# EasyEDA Pro project Mei_v2_EasyEDA_Project.epro

# Schematic Schematic1
Board Name: Board1; Create Date: 2026-04-22; Page Name: P1; Project Name: Mei v2 Autonomous Watering System; Schematic Name: Schematic1; Update Date: 2026-04-25; Company: EasyEDA.com; Page Size: A4; Version: V1.0
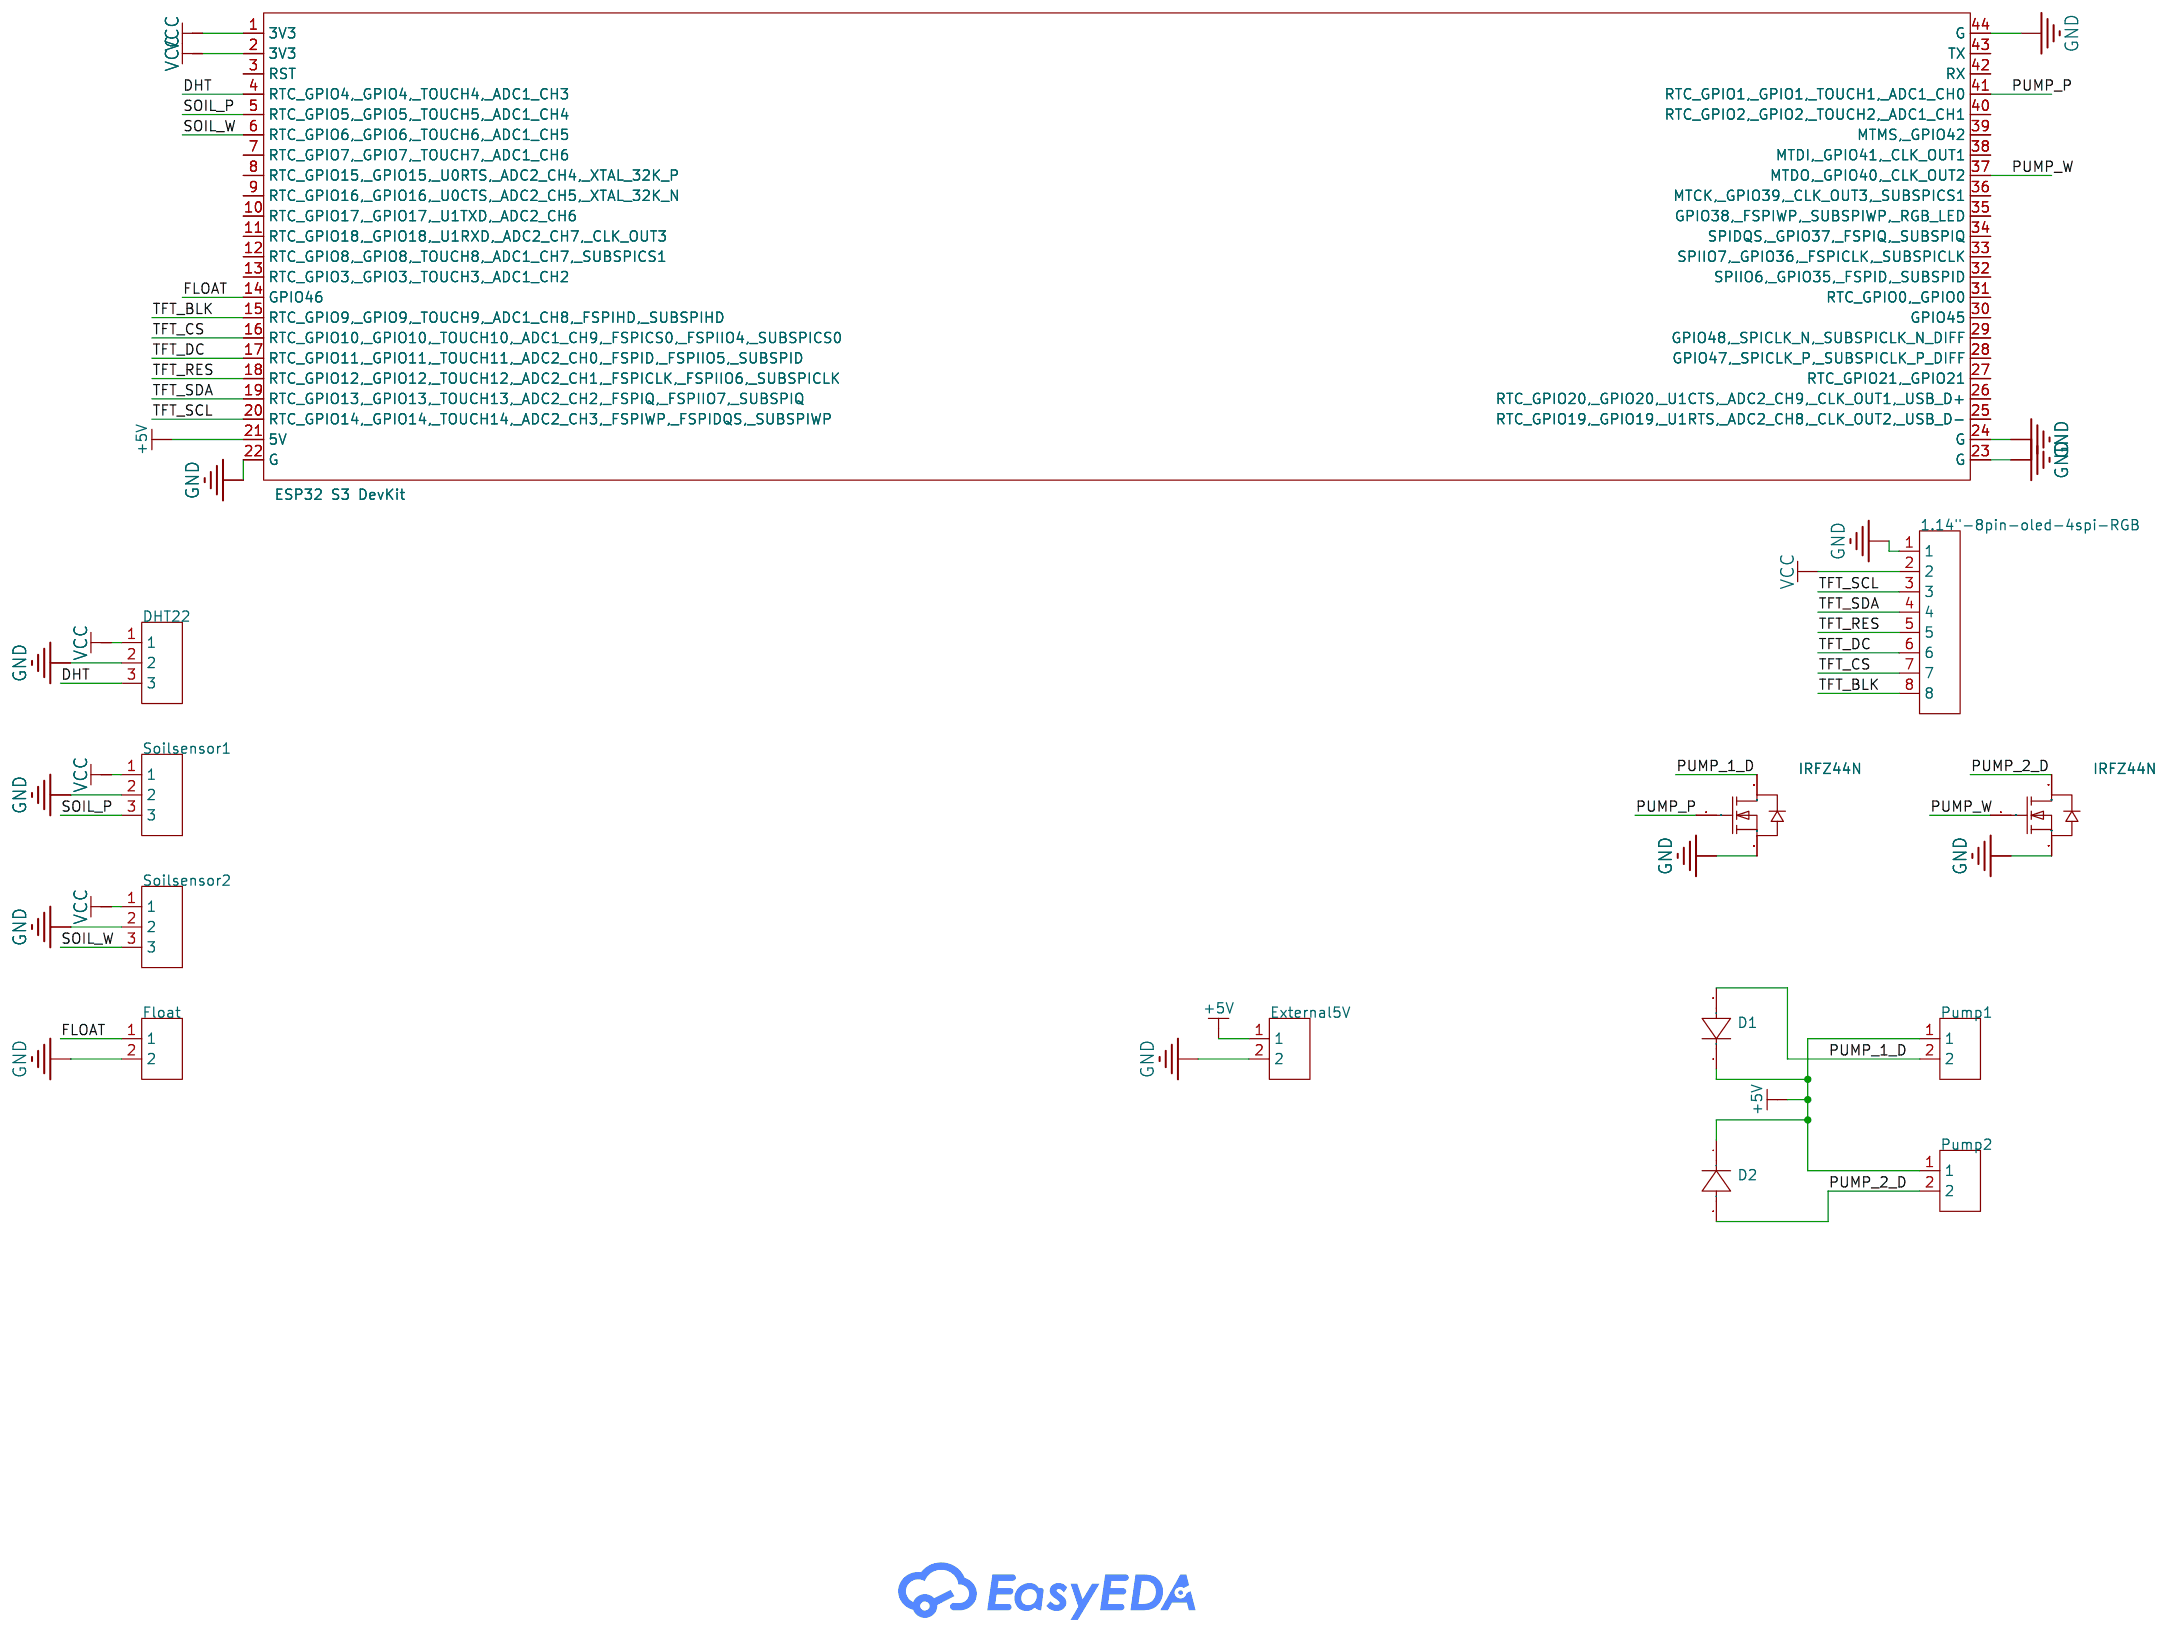
[diagram p0: schematic sheet]

## Parts
1.14"-8pin-oled-4spi-RGB  1.14"-8pin-oled-4spi-RGB  [CONN-TH_8P-P2.54_XH2.54_C9900012080]
D1  -  [DO-41_BD2.4-L4.7-P8.70-D0.9-RD]
D2  -  [DO-41_BD2.4-L4.7-P8.70-D0.9-RD]
DHT22  DHT22  [CONN-TH_3P-P2.50_HX-XHB2.54-3PZZ]
External5V  External 5V  [CONN-TH_2P-P2.50_HX-XHB2.54-2PZZ]
Float  Float  [CONN-TH_2P-P2.50_HX-XHB2.54-2PZZ]
IRFZ44N  IRFZ44N  [TO-220-3_L9.9-W4.5-P2.54-L]
IRFZ44N#2  IRFZ44N  [TO-220-3_L9.9-W4.5-P2.54-L]
Pump1  Pump 1  [CONN-TH_2P-P2.50_HX-XHB2.54-2PZZ]
Pump2  Pump 2  [CONN-TH_2P-P2.50_HX-XHB2.54-2PZZ]
Soilsensor1  Soil sensor 1  [CONN-TH_3P-P2.50_HX-XHB2.54-3PZZ]
Soilsensor2  Soil sensor 2  [CONN-TH_3P-P2.50_HX-XHB2.54-3PZZ]
U2  ESP32 S3 DevKit  [CONN-TH_ESP32-S3-DEVKITC-1U-N8]

## Library data of the parts
1.14"-8pin-oled-4spi-RGB = XH2.54-8: Supplier Part: C9900012080; JLCPCB Part Class: Extended Part; Supplier: LCSC
D1 D2 = 1N4007: Supplier Footprint: DO-41
DHT22 Soilsensor1 Soilsensor2 = HX-XHB2.54-3PZZ: Pins Structure:1x3P Pitch:2.5mm Mounting Type:Through Hole Reference Series:XHB Number of Pins:3P Number of Rows:1 Number of PINs Per Row:3 Row Spacing:- Current Rating:3A Contact Material:Brass Contact Plating:Tin Operating Temperature:-25℃~+85℃ Operatin; LCSC Part Name: 1x3P 间距:2.5mm 直插 系列:XHB; Supplier Part: C48641732; Manufacturer: hanxia(韩下); Supplier Footprint: 插件,P=2.5mm; JLCPCB Part Class: Extended Part; Datasheet: https://item.szlcsc.com/datasheet/HX-XHB2.54-3PZZ/50919928.html; Supplier: LCSC; Pins Structure: 1x3P; Pitch: 2.5mm; Mounting Type: Through Hole; Reference Series: XHB; Number of Pins: 3P; Number of Rows: 1; Number of PINs Per Row: 3; Current Rating: 3A; Contact Material: Brass; Contact Plating: Tin; Operating Temperature: -25℃~+85℃; Voltage Rating: 250V; Plastic Material: PA66; Flame Retardant Rating: UL94V-0; Color: White
External5V Float Pump1 Pump2 = HX-XHB2.54-2PZZ: Pins Structure:1x2P Pitch:2.5mm Mounting Type:Through Hole Reference Series:XHB Number of Pins:2P Number of Rows:1 Number of PINs Per Row:2 Row Spacing:- Current Rating:3A Contact Material:Brass Contact Plating:Tin Operating Temperature:-25℃~+85℃ Operatin; LCSC Part Name: 1x2P 间距:2.5mm 直插 系列:XHB; Supplier Part: C48641731; Manufacturer: hanxia(韩下); Supplier Footprint: 插件,P=2.5mm; JLCPCB Part Class: Extended Part; Datasheet: https://item.szlcsc.com/datasheet/HX-XHB2.54-2PZZ/50919927.html; Supplier: LCSC; Pins Structure: 1x2P; Pitch: 2.5mm; Mounting Type: Through Hole; Reference Series: XHB; Number of Pins: 2P; Number of Rows: 1; Number of PINs Per Row: 2; Current Rating: 3A; Contact Material: Brass; Contact Plating: Tin; Operating Temperature: -25℃~+85℃; Voltage Rating: 250V; Plastic Material: PA66; Flame Retardant Rating: UL94V-0; Color: White
IRFZ44N IRFZ44N#2 = IRFZ44N: Number:1 N-Channel Drain to Source Voltage:60V Current - Continuous Drain(Id):60A RDS(on):12mΩ@10V,25A Pd - Power Dissipation:87W Gate Threshold Voltage (Vgs(th)@Id):3V Gate Charge(Qg):31nC@10V Input Capacitance(Ciss):910pF@25V Reverse Transfer Capacitanc; LCSC Part Name: 1个N沟道 耐压:60V 电流:60A; Supplier Part: C7429904; Manufacturer: minos(迈诺斯); Supplier Footprint: TO-220; JLCPCB Part Class: Extended Part; Datasheet: https://item.szlcsc.com/datasheet/IRFZ44N/8428625.html; Supplier: LCSC; Number: 1 N-Channel; Drain to Source Voltage: 60V; Current - Continuous Drain(Id): 60A; RDS(on): 12mΩ@10V,25A; Pd - Power Dissipation: 87W; Gate Threshold Voltage (Vgs(th)@Id): 3V; Gate Charge(Qg): 31nC@10V; Input Capacitance(Ciss): 910pF@25V; Reverse Transfer Capacitance (Crss@Vds): 30pF@25V; Operating Temperature: -55℃~+175℃@(Tj)
U2 = ESP32-S3-DEVKITC-1-N8R8: LCSC Part Name: 不带固件; Supplier Part: C20541519; Manufacturer: ESPRESSIF(乐鑫); JLCPCB Part Class: Extended Part; Supplier: LCSC

## Nets
+5V: D1.1(K) D2.1(K) External5V.1 Pump1.1 Pump2.1 U2.21(5V)
GND: 1.14"-8pin-oled-4spi-RGB.1 DHT22.2 External5V.2 Float.2 IRFZ44N.3(S) IRFZ44N#2.3(S) Soilsensor1.2 Soilsensor2.2 U2.22(G) U2.23(G) U2.24(G) U2.44(G)
VCC: 1.14"-8pin-oled-4spi-RGB.2 DHT22.1 Soilsensor1.1 Soilsensor2.1 U2.1(3V3) U2.2(3V3)
DHT: DHT22.3 U2.4(RTC_GPIO4, GPIO4, TOUCH4, ADC1_CH3)
FLOAT: Float.1 U2.14(GPIO46)
PUMP_1_D: D1.2(A) IRFZ44N.2(D) Pump1.2
PUMP_2_D: D2.2(A) IRFZ44N#2.2(D) Pump2.2
PUMP_P: IRFZ44N.1(G) U2.41(RTC_GPIO1, GPIO1, TOUCH1, ADC1_CH0)
PUMP_W: IRFZ44N#2.1(G) U2.37(MTDO, GPIO40, CLK_OUT2)
SOIL_P: Soilsensor1.3 U2.5(RTC_GPIO5, GPIO5, TOUCH5, ADC1_CH4)
SOIL_W: Soilsensor2.3 U2.6(RTC_GPIO6, GPIO6, TOUCH6, ADC1_CH5)
TFT_BLK: 1.14"-8pin-oled-4spi-RGB.8 U2.15(RTC_GPIO9, GPIO9, TOUCH9, ADC1_CH8, FSPIHD, SUBSPIHD)
TFT_CS: 1.14"-8pin-oled-4spi-RGB.7 U2.16(RTC_GPIO10, GPIO10, TOUCH10, ADC1_CH9, FSPICS0, FSPIIO4, SUBSPICS0)
TFT_DC: 1.14"-8pin-oled-4spi-RGB.6 U2.17(RTC_GPIO11, GPIO11, TOUCH11, ADC2_CH0, FSPID, FSPIIO5, SUBSPID)
TFT_RES: 1.14"-8pin-oled-4spi-RGB.5 U2.18(RTC_GPIO12, GPIO12, TOUCH12, ADC2_CH1, FSPICLK, FSPIIO6, SUBSPICLK)
TFT_SCL: 1.14"-8pin-oled-4spi-RGB.3 U2.20(RTC_GPIO14, GPIO14, TOUCH14, ADC2_CH3, FSPIWP, FSPIDQS, SUBSPIWP)
TFT_SDA: 1.14"-8pin-oled-4spi-RGB.4 U2.19(RTC_GPIO13, GPIO13, TOUCH13, ADC2_CH2, FSPIQ, FSPIIO7, SUBSPIQ)

Not connected (* = marked no-connect by the designer): U2 3(RST) 7(RTC_GPIO7, GPIO7, TOUCH7, ADC1_CH6) 8(RTC_GPIO15, GPIO15, U0RTS, ADC2_CH4, XTAL_32K_P) 9(RTC_GPIO16, GPIO16, U0CTS, ADC2_CH5, XTAL_32K_N) 10(RTC_GPIO17, GPIO17, U1TXD, ADC2_CH6) 11(RTC_GPIO18, GPIO18, U1RXD, ADC2_CH7, CLK_OUT3) 12(RTC_GPIO8, GPIO8, TOUCH8, ADC1_CH7, SUBSPICS1) 13(RTC_GPIO3, GPIO3, TOUCH3, ADC1_CH2) 25(RTC_GPIO19, GPIO19, U1RTS, ADC2_CH8, CLK_OUT2, USB_D-) 26(RTC_GPIO20, GPIO20, U1CTS, ADC2_CH9, CLK_OUT1, USB_D+) 27(RTC_GPIO21, GPIO21) 28(GPIO47, SPICLK_P, SUBSPICLK_P_DIFF) 29(GPIO48, SPICLK_N, SUBSPICLK_N_DIFF) 30(GPIO45) 31(RTC_GPIO0, GPIO0) 32(SPIIO6, GPIO35, FSPID, SUBSPID) 33(SPIIO7, GPIO36, FSPICLK, SUBSPICLK) 34(SPIDQS, GPIO37, FSPIQ, SUBSPIQ) 35(GPIO38, FSPIWP, SUBSPIWP, RGB LED) 36(MTCK, GPIO39, CLK_OUT3, SUBSPICS1) 38(MTDI, GPIO41, CLK_OUT1) 39(MTMS, GPIO42) 40(RTC_GPIO2, GPIO2, TOUCH2, ADC1_CH1) 42(RX) 43(TX)

# Board PCB3
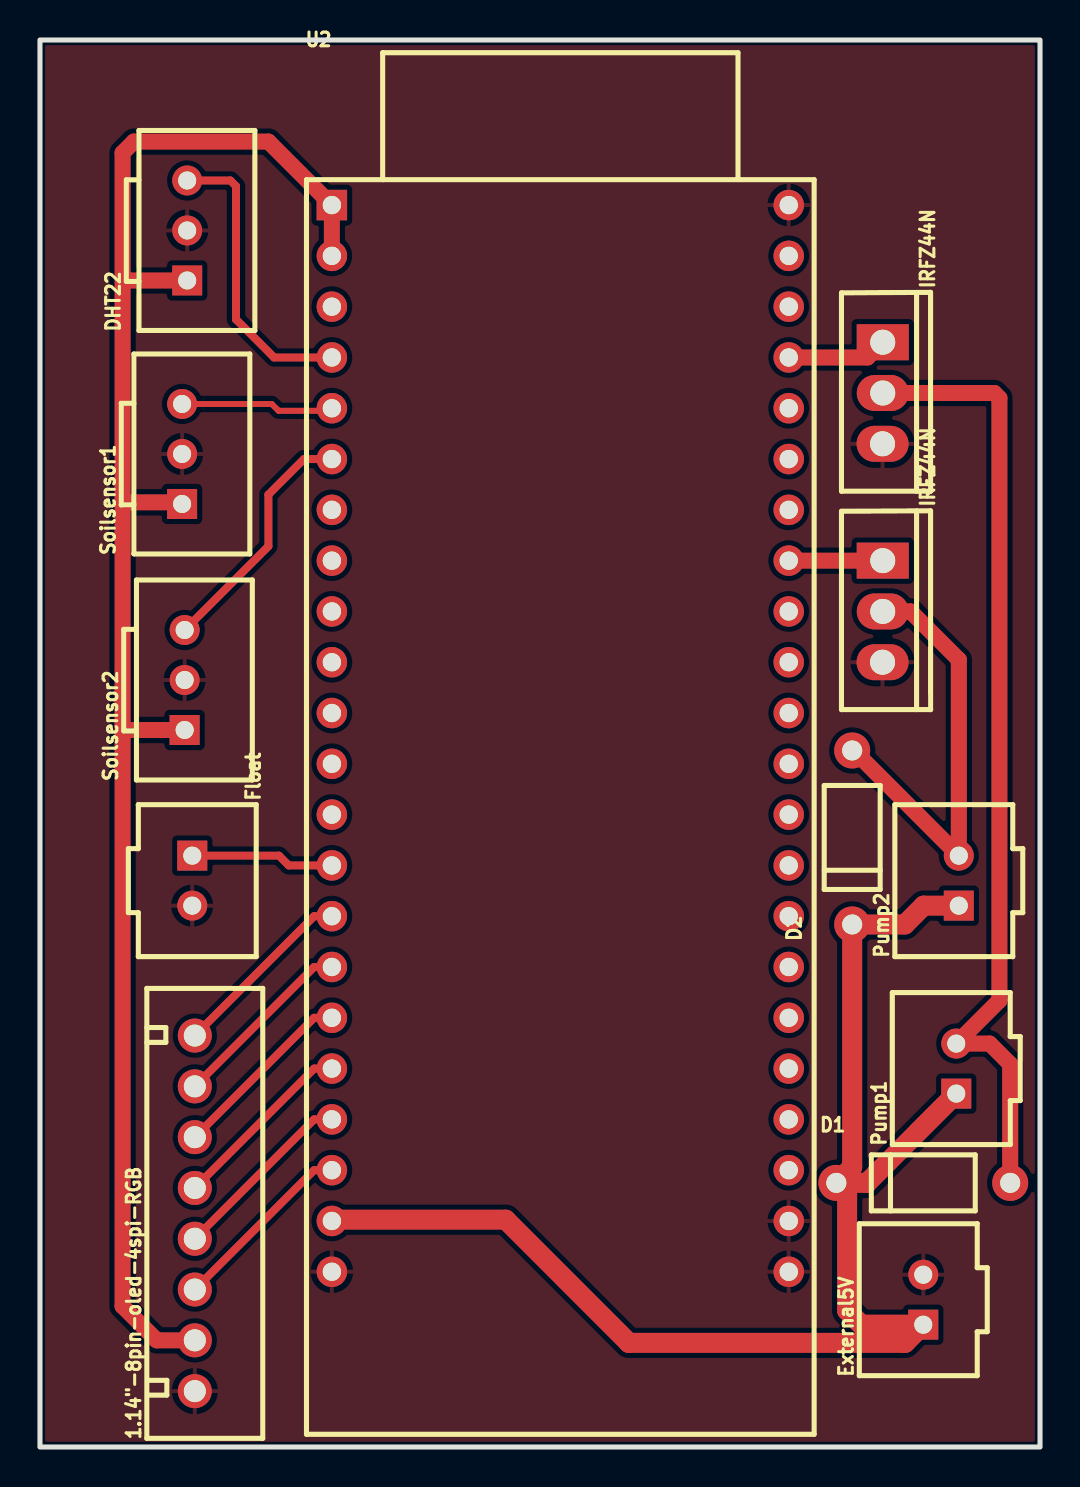
[diagram p1: board, top side]
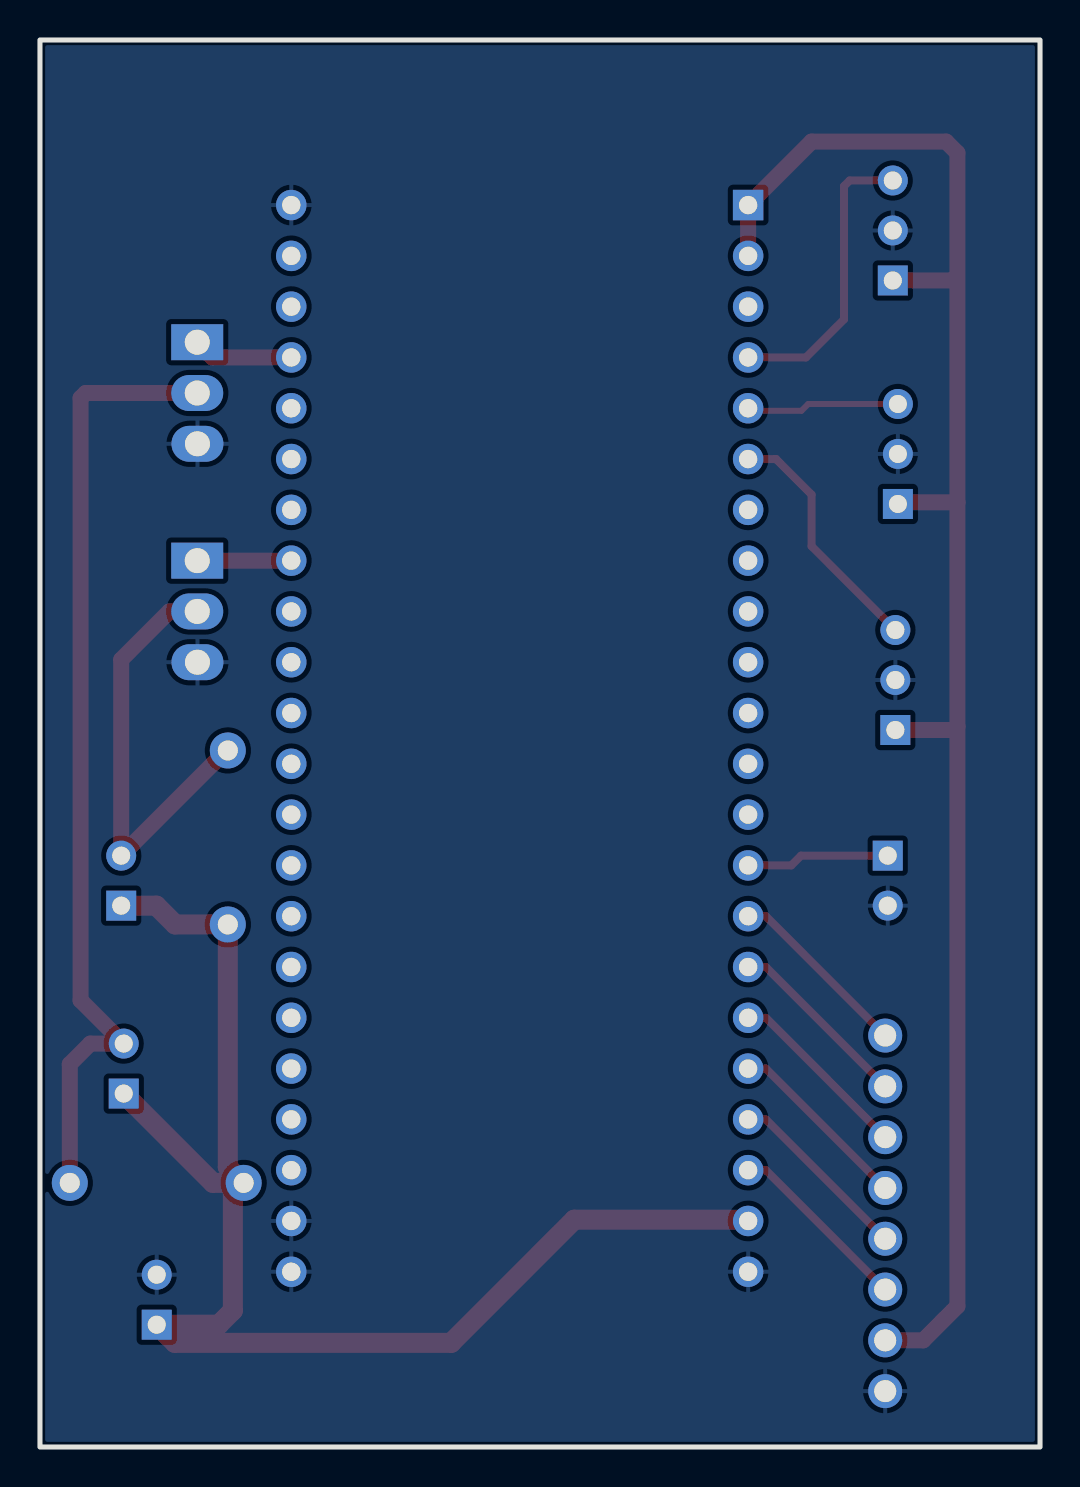
[diagram p2: board, bottom side, seen from below]

Outline 50.04 x 70.36 mm; copper layers: Top Layer, Bottom Layer. Coordinates in mm from the lower left corner of the outline.
Outline path: rectangle 0,70.36 50.04,0
Stack: Top Layer 0.035mm / Dielectric1 1.51mm FR4 er 4.5 / Bottom Layer 0.035mm

## Design rules (mm)
template: Custom Config
spacing copperThickness1oz (default): track to track 0.102, other pairs 0.152 to 0.3
spacing copperThickness2oz: track to track 0.203, other pairs 0.152 to 0.3
track width copperThickness1oz (default): min 0.127, default 0.254, max 2.54
track width copperThickness2oz: min 0.203, default 0.254, max 2.54
differential pair differentialPair (default): width min 0.127, default 0.254, max 2.54; gap min 0.152, default 0.152
via viaSize (default): diameter min 0.5, default 0.61, max 10; hole min 0.3, default 0.305, max 6.3
net GND uses copperRegiondeneme

## Placement (name value [footprint] x y rotation side)
1.14"-8pin-oled-4spi-RGB  1.14"-8pin-oled-4spi-RGB  [CONN-TH_8P-P2.54_XH2.54_C9900012080]  7.75 11.68 90 top
D1  -  [DO-41_BD2.4-L4.7-P8.70-D0.9-RD]  44.2 13.21 0 top
D2  -  [DO-41_BD2.4-L4.7-P8.70-D0.9-RD]  40.64 30.48 90 top
DHT22  DHT22  [CONN-TH_3P-P2.50_HX-XHB2.54-3PZZ]  7.37 60.83 90 top
External5V  External 5V  [CONN-TH_2P-P2.50_HX-XHB2.54-2PZZ]  44.2 7.37 90 top
Float  Float  [CONN-TH_2P-P2.50_HX-XHB2.54-2PZZ]  7.62 28.32 270 top
IRFZ44N  IRFZ44N  [TO-220-3_L9.9-W4.5-P2.54-L]  42.16 52.7 270 top
IRFZ44N#2  IRFZ44N  [TO-220-3_L9.9-W4.5-P2.54-L]  42.16 41.78 270 top
Pump1  Pump 1  [CONN-TH_2P-P2.50_HX-XHB2.54-2PZZ]  45.85 18.92 90 top
Pump2  Pump 2  [CONN-TH_2P-P2.50_HX-XHB2.54-2PZZ]  45.97 28.32 90 top
Soilsensor1  Soil sensor 1  [CONN-TH_3P-P2.50_HX-XHB2.54-3PZZ]  7.11 49.66 90 top
Soilsensor2  Soil sensor 2  [CONN-TH_3P-P2.50_HX-XHB2.54-3PZZ]  7.24 38.35 90 top
U2  ESP32 S3 DevKit  [CONN-TH_ESP32-S3-DEVKITC-1U-N8]  26.03 35.43 0 top

## Footprints (pads in the part's own frame, mm; a bottom-side part is the same pattern mirrored in y, then rotated)
CONN-TH_2P-P2.50_HX-XHB2.54-2PZZ
  rect 1.5x1.5 hole 0.9: 1(-1.25,0)
  round 1.5 hole 0.9: 2(1.25,0)
CONN-TH_3P-P2.50_HX-XHB2.54-3PZZ
  rect 1.5x1.5 hole 0.9: 1(-2.5,0)
  round 1.5 hole 0.9: 2(0,0) 3(2.5,0)
CONN-TH_8P-P2.54_XH2.54_C9900012080
  round 1.7 hole 1.1: 1(-8.89,0) 2(-6.35,0) 3(-3.81,0) 4(-1.27,0) 5(1.27,0) 6(3.81,0) 7(6.35,0) 8(8.89,0)
CONN-TH_ESP32-S3-DEVKITC-1U-N8
  rect 1.524x1.524 hole 0.914: 1(-11.43,26.67)
  round 1.524 hole 0.914: 2(-11.43,24.13) 3(-11.43,21.59) 4(-11.43,19.05) 5(-11.43,16.51) 6(-11.43,13.97) 7(-11.43,11.43) 8(-11.43,8.89) 9(-11.43,6.35) 10(-11.43,3.81) 11(-11.43,1.27) 12(-11.43,-1.27) 13(-11.43,-3.81) 14(-11.43,-6.35) 15(-11.43,-8.89) 16(-11.43,-11.43) 17(-11.43,-13.97) 18(-11.43,-16.51) 19(-11.43,-19.05) 20(-11.43,-21.59) 21(-11.43,-24.13) 22(-11.43,-26.67) 23(11.43,-26.67) 24(11.43,-24.13) 25(11.43,-21.59) 26(11.43,-19.05) 27(11.43,-16.51) 28(11.43,-13.97) 29(11.43,-11.43) 30(11.43,-8.89) 31(11.43,-6.35) 32(11.43,-3.81) 33(11.43,-1.27) 34(11.43,1.27) 35(11.43,3.81) 36(11.43,6.35) 37(11.43,8.89) 38(11.43,11.43) 39(11.43,13.97) 40(11.43,16.51) 41(11.43,19.05) 42(11.43,21.59) 43(11.43,24.13) 44(11.43,26.67)
DO-41_BD2.4-L4.7-P8.70-D0.9-RD
  round 1.8 hole 1: 1(-4.35,0) 2(4.35,0)
TO-220-3_L9.9-W4.5-P2.54-L
  rect 1.8x2.6 hole 1.25: 1(-2.54,0.005)
  oval 1.8x2.6 hole 1.25: 2(0,0.005) 3(2.54,-0.005)

## Nets
As in the schematic.

Pads without a net: U2 3 7 8 9 10 11 12 13 25 26 27 28 29 30 31 32 33 34 35 36 38 39 40 42 43

## Routing (per net, layer and track width the routed paths; a pad name or vN(x,y) marks a point on that pad's centre or on a via; arc(x,y) is an arc through that point)
+5V: length 70.1
  Top Layer w1: Pump1.1 41.38,13.21 D1.1 ; D1.1 40.64,14 D2.1 43.28,26.13 44.22,27.07 Pump2.1 ; D1.1 40.39,12.67 40.39,6.82 41.09,6.12 External5V.1 43.29,5.21 29.46,5.21 23.3,11.37 14.67,11.37 U2.21
VCC: length 85.8
  Top Layer w0.8: U2.2 U2.1 11.43,65.28 4.7,65.28 4.13,64.71 4.13,47.24 ; 4.32,58.42 4.41,58.33 DHT22.1 ; 1.14"-8pin-oled-4spi-RGB.2 5.84,5.33 4.13,7.04 4.13,36.03 ; 4.13,47.24 4.13,36.03 ; 4.13,47.24 7.03,47.24 Soilsensor1.1 ; 4.13,36.03 4.31,35.85 Soilsensor2.1
DHT: length 14.8
  Top Layer w0.4: U2.4 11.71,54.48 9.81,56.39 9.81,63.05 9.53,63.33 DHT22.3
FLOAT: length 7.2
  Top Layer w0.4: Float.1 11.96,29.57 12.45,29.08 U2.14
PUMP_1_D: length 48.2
  Top Layer w0.8: D1.2 48.55,19.14 47.52,20.17 Pump1.2 48.01,22.33 48.01,52.45 47.75,52.7 IRFZ44N.2
PUMP_2_D: length 22.1
  Top Layer w0.8: D2.2 40.72,34.83 Pump2.2 45.97,39.37 43.56,41.78 IRFZ44N#2.2
PUMP_P: length 5
  Top Layer w0.8: U2.41 41.41,54.48 IRFZ44N.1
PUMP_W: length 4.7
  Top Layer w0.8: IRFZ44N#2.1 U2.37
SOIL_P: length 7.7
  Top Layer w0.3: U2.5 14.48,51.82 11.94,51.82 11.6,52.16 Soilsensor1.3
SOIL_W: length 12.4
  Top Layer w0.4: U2.6 13.21,49.4 11.43,47.62 11.43,45.05 Soilsensor2.3
TFT_BLK: length 9.3
  Top Layer w0.4: 1.14"-8pin-oled-4spi-RGB.8 13.72,26.54 U2.15
TFT_CS: length 9.3
  Top Layer w0.4: U2.16 13.72,24 7.75,18.03
TFT_DC: length 9.3
  Top Layer w0.4: 1.14"-8pin-oled-4spi-RGB.6 13.72,21.46 U2.17
TFT_RES: length 9.3
  Top Layer w0.4: 1.14"-8pin-oled-4spi-RGB.5 13.72,18.92 U2.18
TFT_SCL: length 9.3
  Top Layer w0.4: U2.20 13.72,13.84 1.14"-8pin-oled-4spi-RGB.3
TFT_SDA: length 9.3
  Top Layer w0.4: U2.19 13.72,16.38 1.14"-8pin-oled-4spi-RGB.4

## Copper pours and planes (outline as drawn; the poured copper is in the pictures)
GND on Top Layer: 0,70.36 50.16,70.36 50.16,0 0,0
GND on Bottom Layer: 0,70.36 50.04,70.36 50.04,0 0,0
